# EAGLE design CCM_0023_revB (EAGLE 9.4.2)
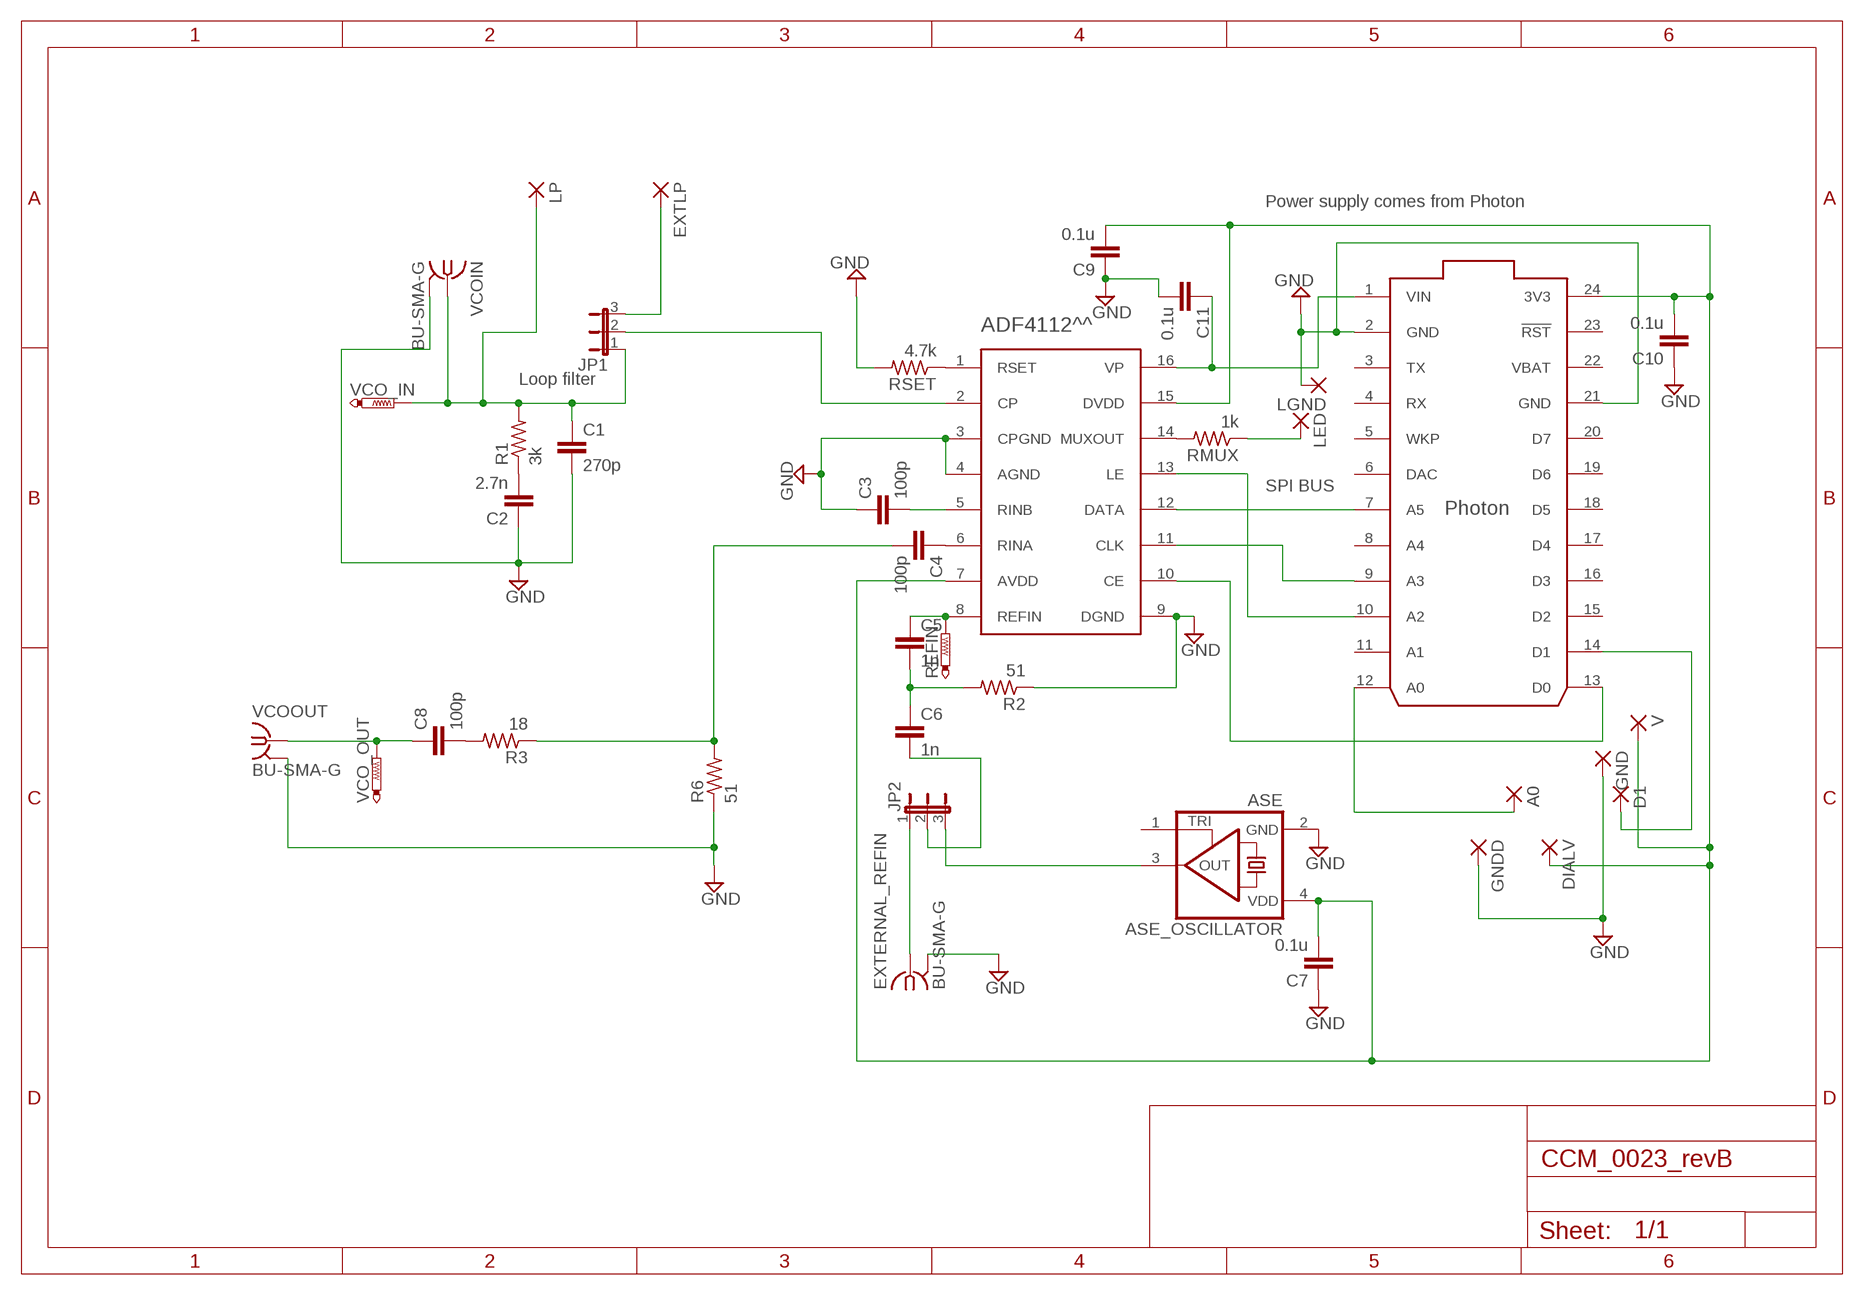
[diagram p0: schematic, sheet 1]

## Parts
A0  1,6/0,8  [1,6/0,8]
ADF4112^^  ADF4112  [ADF4112]
ASE_OSCILLATOR  ASE  [ASE]
C1  270p  CC0603  [C0603]
C2  2.7n  CC0603  [C0603]
C3  100p  CC0603  [C0603]
C4  100p  CC0603  [C0603]
C5  1n  CC0603  [C0603]
C6  1n  CC0603  [C0603]
C7  0.1u  CC0603  [C0603]
C8  100p  CC0603  [C0603]
C9  0.1u  CC0603  [C0603]
C10  0.1u  CC0603  [C0603]
C11  0.1u  CC0603  [C0603]
D1  1,6/0,8  [1,6/0,8]
DIALV  1,6/0,8  [1,6/0,8]
EXTERNAL_REFIN  BU-SMA-G  [BU-SMA-G]
EXTLP  1,6/0,8  [1,6/0,8]
GND  1,6/0,8  [1,6/0,8]
GNDD  1,6/0,8  [1,6/0,8]
JP1  JP2E  [JP2]
JP2  JP2E  [JP2]
LED  1,6/0,8  [1,6/0,8]
LGND  1,6/0,8  [1,6/0,8]
LP  1,6/0,8  [1,6/0,8]
PHOTON  PHOTON_WITH_HEADERS  [PHOTON]
R1  3k  R-US_R0603  [R0603]
R2  51  R-US_R0603  [R0603]
R3  18  R-US_R0603  [R0603]
R6  51  R-US_R0603  [R0603]
REFIN  PTR1B2,54  [B2,54]
RMUX  1k  R-US_R0603  [R0603]
RSET  4.7k  R-US_R0603  [R0603]
V  1,6/0,8  [1,6/0,8]
VCO_IN  PTR1B2,54  [B2,54]
VCO_OUT  PTR1B2,54  [B2,54]
VCOIN  BU-SMA-G  [BU-SMA-G]
VCOOUT  BU-SMA-G  [BU-SMA-G]

## Nets
GND: ADF4112^^.3(CPGND) ADF4112^^.4(AGND) ADF4112^^.9(DGND) ASE_OSCILLATOR.2(GND) C1.2 C2.1 C3.1 C7.1 C9.1 C10.1 C11.2 EXTERNAL_REFIN.2 EXTERNAL_REFIN.3 EXTERNAL_REFIN.4 EXTERNAL_REFIN.5 GND.1(P) GNDD.1(P) LGND.1(P) PHOTON.2(GND) PHOTON.21(GND) R2.1 R6.1 RSET.2 VCOIN.2 VCOIN.3 VCOIN.4 VCOIN.5 VCOOUT.2 VCOOUT.3 VCOOUT.4 VCOOUT.5
N$1: ADF4112^^.12(DATA) PHOTON.7(A5)
N$2: ADF4112^^.11(CLK) PHOTON.9(A3)
N$3: ADF4112^^.13(LE) PHOTON.10(A2)
N$4: ADF4112^^.1(RSET) RSET.1
N$5: C2.2 R1.1
N$6: EXTERNAL_REFIN.1 JP2.1
N$7: ASE_OSCILLATOR.3(OUT) JP2.3
N$8: ADF4112^^.8(REFIN) C5.1 REFIN.TP
N$9: C5.2 C6.1 R2.2
N$10: ADF4112^^.5(RINB) C3.2
N$11: ADF4112^^.14(MUXOUT) RMUX.2
N$12: C8.1 VCO_OUT.TP VCOOUT.1
N$13: A0.1(P) PHOTON.12(A0)
N$14: D1.1(P) PHOTON.14(D1)
N$15: ADF4112^^.16(VP) C11.1 PHOTON.1(VIN)
N$16: C8.2 R3.2
N$17: C4.2 R3.1 R6.2
N$18: ADF4112^^.6(RINA) C4.1
N$19: LED.1(P) RMUX.1
N$21: ADF4112^^.7(AVDD) ADF4112^^.15(DVDD) ASE_OSCILLATOR.4(VDD) C7.2 C9.2 C10.2 DIALV.1(P) PHOTON.24(3V3) V.1(P)
N$22: EXTLP.1(P) JP1.3
N$23: ADF4112^^.2(CP) JP1.2
N$25: ADF4112^^.10(CE) PHOTON.13(D0)
N$26: C1.1 JP1.1 LP.1(P) R1.2 VCO_IN.TP VCOIN.1
N$27: C6.2 JP2.2
Unconnected: ASE_OSCILLATOR.1(TRI) PHOTON.3(TX) PHOTON.4(RX) PHOTON.5(WKP) PHOTON.6(DAC) PHOTON.8(A4) PHOTON.11(A1) PHOTON.15(D2) PHOTON.16(D3) PHOTON.17(D4) PHOTON.18(D5) PHOTON.19(D6) PHOTON.20(D7) PHOTON.23(!RST)

## Notes on the sheet
- Power supply comes from Photon
- Loop filter
- SPI BUS

## Power pins joined to a net without a drawn wire
VBAT: PHOTON.22(VBAT)

## Library data of the parts
A0 D1 DIALV EXTLP GND GNDD LED LGND LP V = wirepad:1,6/0,8: THROUGH-HOLE PAD
ADF4112^^ = ADF4112:ADF4112: Specifications: -AVdd: Analogue power supply 2.7V to 5.5V -DGND: Digital ground -DVdd: Digital power supply: 2.7V to 5.5V -Vp: Charge pump power supply: greater or equal to Vdd
ASE_OSCILLATOR = crystal:ASE: 3.3Vdc CMOS SMD CRYSTAL CLOCK OSCILLATOR SOurce: www.abracon.com; OC_FARNELL: unknown; OC_NEWARK: unknown
C1-C11 = eagle-ltspice:C: CAPACITOR, European symbol; SPICEMODEL: NONE; SPICEPREFIX: C
EXTERNAL_REFIN VCOIN VCOOUT = con-coax:BU-SMA-G: FEMALE SMA CONNECTOR Radiall distributor RS 193-9117; OC_FARNELL: unknown; OC_NEWARK: unknown
JP1 JP2 = jumper:JP2E: JUMPER
PHOTON = Spark:PHOTON
R1-R3 R6 RMUX RSET = rcl:R-US_: RESISTOR, American symbol
REFIN VCO_IN VCO_OUT = testpad:PTR1: TEST PIN

## Net classes
1 standard: width 0.61 mm, clearance 0.254 mm

## Board
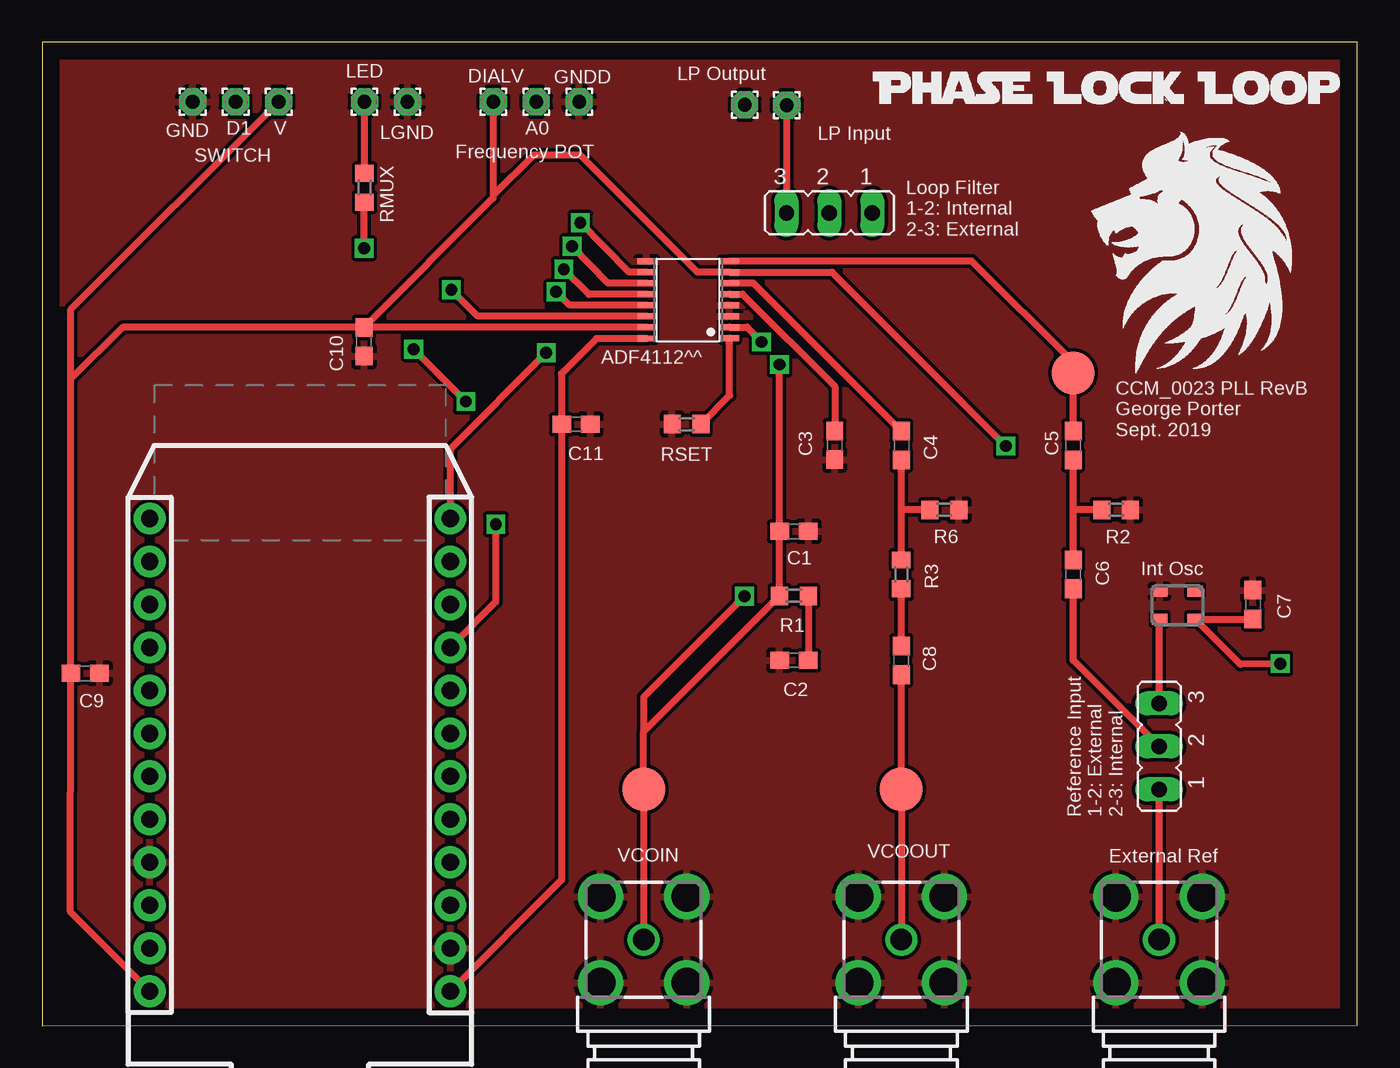
[diagram p1: board, top side]
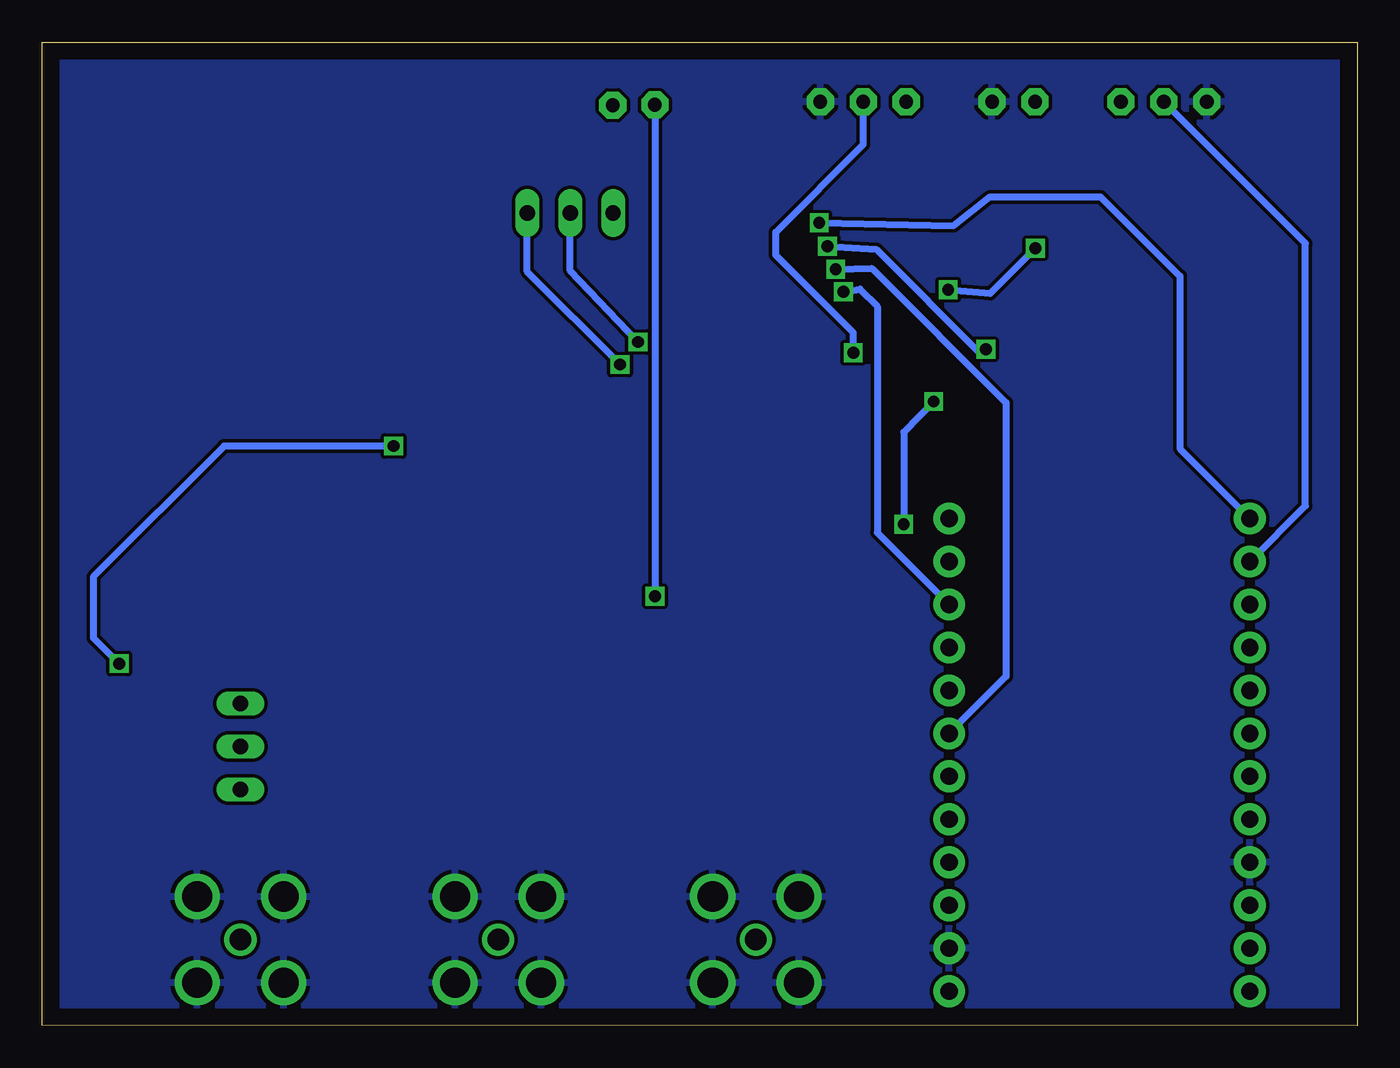
[diagram p2: board, bottom side, seen from below]

Size 77.76 x 58.12 mm. Coordinates in mm from the lower left corner, seen from the top.
Outline: 0,0 77.75,0.02 77.75,58.12 0,58.12 0,0
Copper layers (1*16): Top 0.035mm / dielectric 1.5mm / Bottom 0.035mm
Design rules "default": minimum track width 10mil, minimum drill 24mil, track to track 8mil, track to pad 8mil, pad to pad 8mil, via to via 8mil, smd to smd 8mil, copper to edge 40mil, drill to drill 8mil, minimum pad ring 10mil, minimum via ring 8mil, stop-mask expansion 4mil, vias tented up to drill 0mil, thermal gap 10mil

### Footprints (pad centres in the part's own frame; a part is rotated, then mirrored left to right if it is on the bottom)
1,6/0,8 = drill 0.813 pad 1.6 octagon: 1 0,0
ADF4112 = smd 0.35 x 1.1: 1 0,0; 2 0.65,0; 3 1.3,0; 4 1.95,0; 5 2.6,0; 6 3.25,0; 7 3.9,0; 8 4.55,0; 9 4.55,4.9; 10 3.9,4.9; 11 3.25,4.9; 12 2.6,4.9; 13 1.95,4.9; 14 1.3,4.9; 15 0.65,4.9; 16 -0.025,4.902
ASE = smd 0.9 x 0.65: 1 -1.05,-0.825; 2 1.05,-0.825; 3 1.05,0.825; 4 -1.05,0.825
C0603 = smd 1.1 x 1: 1 -0.85,0; 2 0.85,0
BU-SMA-G = drill 1.27: 1 0,0 | drill 1.778: 2 -2.55,2.55; 3 2.55,2.55; 4 2.55,-2.55; 5 -2.55,-2.55
JP2 = drill 0.914 long: 1 -2.54,0; 2 0,0; 3 2.54,0
PHOTON = drill 1.016 pad 1.88: 1 1.27,32.258; 2 1.27,29.718; 3 1.27,27.178; 4 1.27,24.638; 5 1.27,22.098; 6 1.27,19.558; 7 1.27,17.018; 8 1.27,14.478; 9 1.27,11.938; 10 1.27,9.398; 11 1.27,6.858; 12 1.27,4.318; 13 19.05,4.318; 14 19.05,6.858; 15 19.05,9.398; 16 19.05,11.938; 17 19.05,14.478; 18 19.05,17.018; 19 19.05,19.558; 20 19.05,22.098; 21 19.05,24.638; 22 19.05,27.178; 23 19.05,29.718; 24 19.05,32.258
R0603 = smd 1 x 1.1: 1 -0.85,0; 2 0.85,0
B2,54 = smd 2.54 x 2.54: TP 0,0

### Placement (x,y rotation side)
A0  29.21,54.61 0 top
ADF4112^^  40.64,40.64 90 top
ASE_OSCILLATOR  67.12,24.86 180 top
C1  44.45,29.21 0 top
C2  44.45,21.59 0 top
C3  46.86,34.3 90 top
C4  50.8,34.29 270 top
C5  60.96,34.29 270 top
C6  60.96,26.67 270 top
C7  71.59,24.89 270 top
C8  50.8,21.59 90 top
C9  2.54,20.83 180 top
C10  19.02,40.42 90 top
C11  31.56,35.54 0 top
D1  11.43,54.61 0 top
DIALV  26.67,54.61 0 top
EXTERNAL_REFIN  66.04,5.08 270 top
EXTLP  44.02,54.4 0 top
GND  8.89,54.61 180 top
GNDD  31.75,54.61 0 top
JP1  46.55,48.04 180 top
JP2  66.04,16.51 90 top
LED  19.05,54.61 0 top
LGND  21.59,54.61 180 top
LP  41.53,54.43 0 top
PHOTON  25.4,34.29 180 top
R1  44.45,25.4 180 top
R2  63.5,30.48 180 top
R3  50.8,26.67 270 top
R6  53.34,30.48 180 top
REFIN  60.96,38.56 0 top
RMUX  19.05,49.53 270 top
RSET  38.1,35.56 180 top
V  13.97,54.61 0 top
VCO_IN  35.56,13.97 0 top
VCO_OUT  50.8,13.97 0 top
VCOIN  35.56,5.08 270 top
VCOOUT  50.8,5.08 270 top

### Tracks (layer width: path | path; a pad name or v marks a point on that pad's centre or on a via)
GND
  pour Top: 0,0 0,58.06 77.73,58.06 77.73,0
  pour Bottom: 0,0 0,58.23 77.71,58.23 77.71,0
N$1  (via drill 0.7)
  Top 0.406: ADF4112^^.12 32.32,43.23 v30.84,44.71
  Bottom 0.406: v30.84,44.71 28.7,44.76 20.77,36.82 20.77,20.64 PHOTON.7
N$2  (via drill 0.7)
  Top 0.406: ADF4112^^.11 33.44,43.89 v31.33,46.07 | v21.96,39.98 25.15,36.79 v25.04,36.9 | v26.82,29.63 26.82,25.04 PHOTON.9
  Bottom 0.406: v31.33,46.07 28.44,45.88 22.27,39.71 v21.96,39.98 | v25.04,36.9 26.82,35.08 v26.82,29.63
N$3  (via drill 0.7)
  Top 0.406: ADF4112^^.13 31.18,42.59 v30.38,43.38
  Bottom 0.406: v30.38,43.38 29.39,43.53 28.38,42.52 28.38,29.14 PHOTON.10
N$4
  Top 0.406: RSET.1 40.64,37.25 ADF4112^^.1
N$5
  Top 0.406: R1.1 C2.2
N$6
  Top 0.406: EXTERNAL_REFIN.1 JP2.1
N$7
  Top 0.406: JP2.3 66.04,24 ASE_OSCILLATOR.3
N$8
  Top 0.406: C5.1 REFIN.TP 60.96,39.2 54.97,45.19 ADF4112^^.8
N$9
  Top 0.406: C6.1 60.96,30.48 | 60.96,30.48 C5.2 | R2.2 60.96,30.48
N$10
  Top 0.406: ADF4112^^.5 41.41,43.24 46.86,37.79 C3.2
N$11  (via drill 0.7)
  Top 0.406: ADF4112^^.14 25.74,41.94 v24.19,43.5 | v19.03,45.95 19.03,48.66 RMUX.2
  Bottom 0.406: v24.19,43.5 21.7,43.28 v19.03,45.95
N$12
  Top 0.406: VCOOUT.1 VCO_OUT.TP C8.1
N$13  (via drill 0.7)
  Top 0.406: PHOTON.12 24.13,34.11 v29.8,39.78
  Bottom 0.406: v29.8,39.78 29.8,40.97 34.38,45.55 34.38,46.91 29.2,52.09 A0.1
N$14
  Bottom 0.406: PHOTON.14 3.06,30.72 3.06,46.24 D1.1
N$15
  Top 0.406: ADF4112^^.16 32.77,40.62 30.7,38.55 C11.1 30.71,8.61 PHOTON.1
N$16
  Top 0.406: C8.2 R3.2
N$17
  Top 0.406: R3.1 50.8,30.48 | 50.8,30.48 C4.2 | R6.2 50.8,30.48
N$18
  Top 0.406: C4.1 42.05,43.89 ADF4112^^.6
N$19
  Top 0.406: RMUX.1 LED.1
N$21  (via drill 0.7)
  Top 0.406: C7.2 ASE_OSCILLATOR.4 70.85,21.36 v73.21,21.4 | PHOTON.24 1.67,6.72 C9.2 1.69,38.22 | 1.69,38.22 1.69,42.33 V.1 | C10.2 4.74,41.27 1.69,38.22 | ADF4112^^.15 19.04,41.29 C10.2 | DIALV.1 26.67,49.08 | 26.67,49.08 26.67,48.92 C10.2 | 26.67,49.08 29.06,51.46 31.82,51.46 38.74,44.54 ADF4112^^.7 46.7,44.54 v56.98,34.26
  Bottom 0.406: v56.98,34.26 67,34.26 74.73,26.53 74.73,22.92 v73.21,21.4
N$22
  Top 0.406: JP1.3 44.02,50.38 EXTLP.1
N$23  (via drill 0.7)
  Top 0.406: ADF4112^^.2 41.67,41.29 v42.53,40.41
  Bottom 0.406: v42.53,40.41 46.55,44.62 JP1.2
N$25  (via drill 0.7)
  Top 0.406: ADF4112^^.10 34.7,44.54 v31.81,47.45
  Bottom 0.406: v31.81,47.45 23.88,47.3 21.71,48.99 15.18,48.99 10.48,44.3 10.48,34.11 PHOTON.13
N$26  (via drill 0.7)
  Top 0.406: VCOIN.1 VCO_IN.TP 35.56,17.36 | 35.56,17.36 R1.2 C1.1 v43.59,39.08 | v41.52,25.38 35.56,19.42 35.56,17.36
  Bottom 0.406: v43.59,39.08 49.09,44.57 JP1.1 | LP.1 v41.52,25.38
N$27
  Top 0.406: JP2.2 60.96,21.59 C6.2

### Text on the board
bOrigins: C:/Users/spectre ae000ne/Documents/UROP 2019/Presentation/Untitled.bmp
tNames: LP Output | LP Input | SWITCH | Frequency POT | Loop Filter / 1-2: Internal / 2-3: External | CCM_0023 PLL RevB / George Porter / Sept. 2019 | Int Osc | Reference Input / 1-2: External / 2-3: Internal | External Ref